# Altium schematic sheet Core.schdoc
size 297 x 209 mm; Symbol: Drawing-Symbol_A4; @Project Name: Weather-Station; @Page Count: 2; @Update Date: 2026-03-24; @Create Date: 2025-12-25; @Schematic Name: Mainboard; @Page No: 1; @Page Name: Core; Company: EasyEDA.com; Version: V1.0; Page Size: A4; @Create Time: 10:59:44; @Update Time: 15:00:32; Border: 1; Width: 1170; Height: 825; Region Start: 1; X Region Count: 6; Y Region Count: 4; Blade Width: 10; Title Block Position: 3; @Board Name: Mainboard; Device: Drawing-Symbol_A4
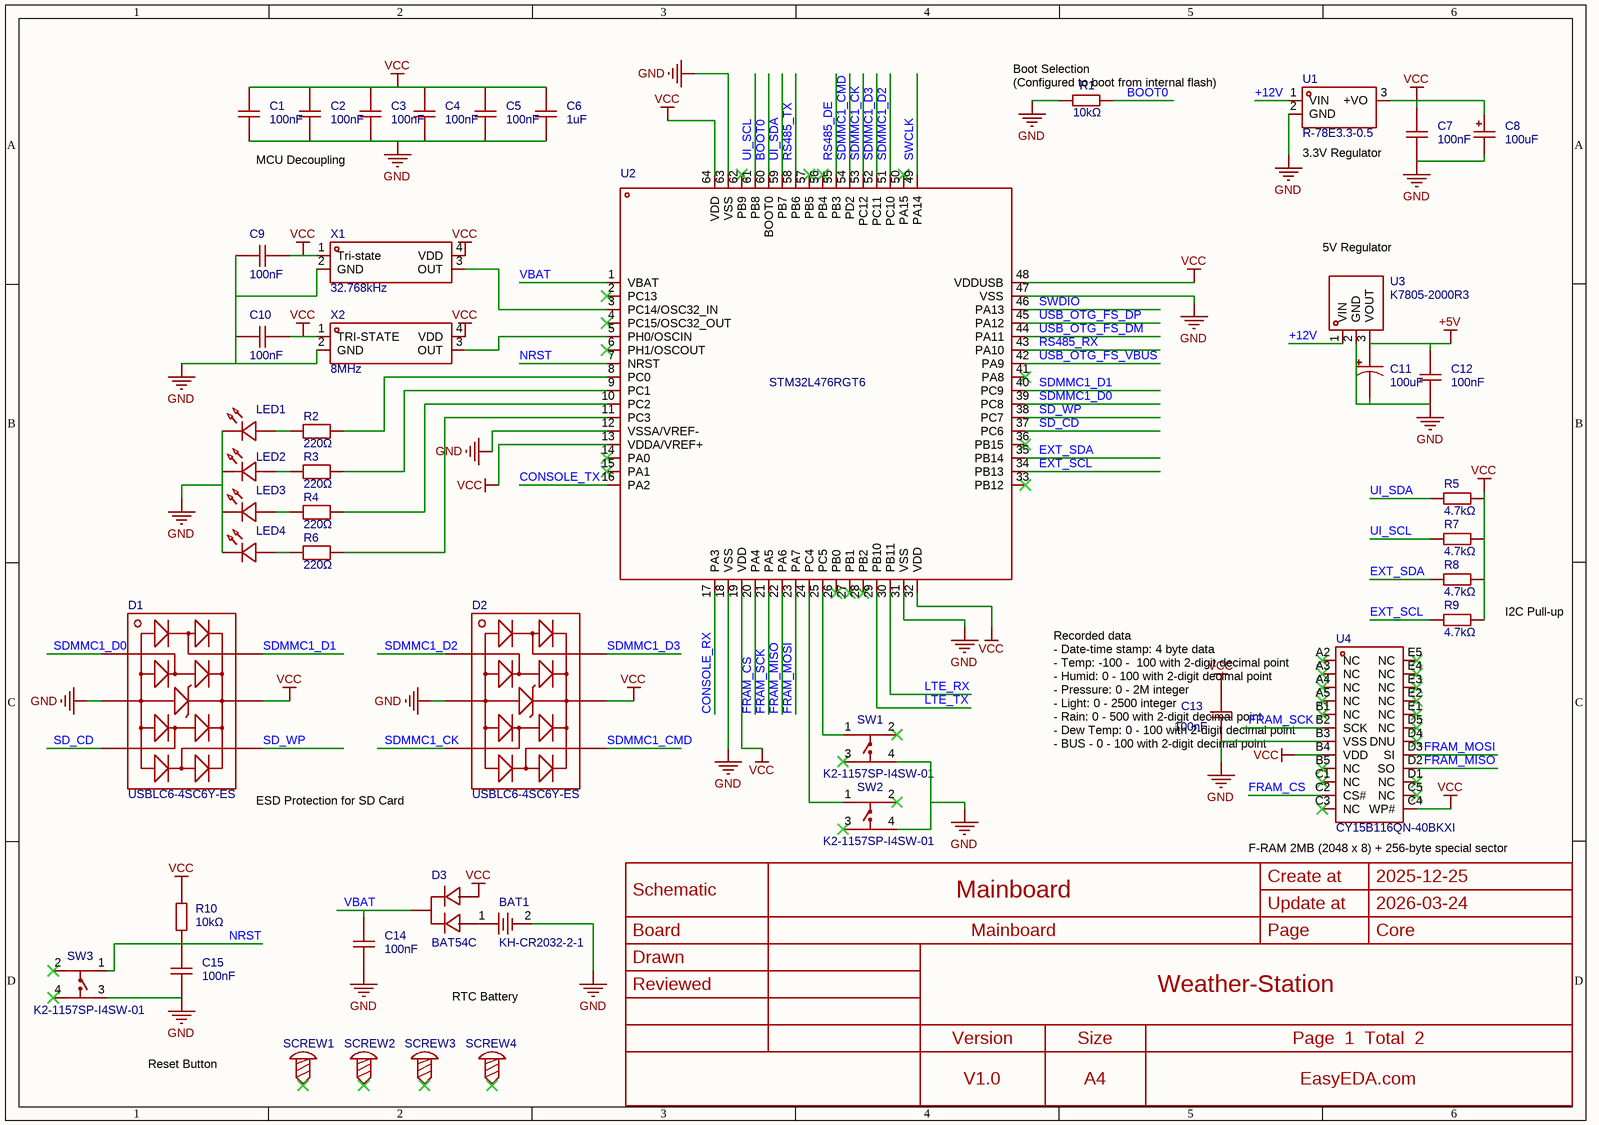
[diagram p0: Core.schdoc]

## Parts
BAT1  KH-CR2032-2-1  [BAT-TH_KH-CR2032-2-1]
C1  100nF  [C0402]
C2  100nF  [C0402]
C3  100nF  [C0402]
C4  100nF  [C0402]
C5  100nF  [C0402]
C6  1uF  [C0603]
C7  100nF  [C0402]
C8  100uF  [CASE-B_3528]
C9  100nF  [C0402]
C10  100nF  [C0402]
C11  100uF  [CAP-SMD_L3.5-W2.8-R-RD]
C12  100nF  [C0402]
C13  100nF  [C0402]
C14  100nF  [C0402]
C15  100nF  [C0402]
D1  USBLC6-4SC6Y-ES  [TSOT-23-6_L2.9-W1.6-P0.95-LS2.8-BR]
D2  USBLC6-4SC6Y-ES  [TSOT-23-6_L2.9-W1.6-P0.95-LS2.8-BR]
D3  BAT54C  [SOT-23-3_L2.9-W1.3-P1.90-LS2.4-BR]
LED1  TZ-P2-0402RTIA1-0.45T  [LED0402-RD_RED]  (value not drawn)
LED2  XL-1005UYC  [LED0402-FD_YELLOW]  (value not drawn)
LED3  BL-HGK37A-AV-TRB  [LED0402]  (value not drawn)
LED4  SZYY0402B  [LED0402-RD_BLUE]  (value not drawn)
R1  10kΩ  [R0402]
R2  220Ω  [R0402]
R3  220Ω  [R0402]
R4  220Ω  [R0402]
R5  4.7kΩ  [R0402]
R6  220Ω  [R0402]
R7  4.7kΩ  [R0402]
R8  4.7kΩ  [R0402]
R9  4.7kΩ  [R0402]
R10  10kΩ  [R0402]
SCREW1  (no value)  [Screw-Hole-M3]
SCREW2  (no value)  [Screw-Hole-M3]
SCREW3  (no value)  [Screw-Hole-M3]
SCREW4  (no value)  [Screw-Hole-M3]
SW1  K2-1157SP-I4SW-01  [SW-SMD_4P-L6.2-W6.2-P4.50-LS8.6]
SW2  K2-1157SP-I4SW-01  [SW-SMD_4P-L6.2-W6.2-P4.50-LS8.6]
SW3  K2-1157SP-I4SW-01  [SW-SMD_4P-L6.2-W6.2-P4.50-LS8.6]
U1  R-78E3.3-0.5  [PWRM-TH_YLPTEC_R-78EXXX]
U2  STM32L476RGT6  [LQFP-64_L10.0-W10.0-P0.50-LS12.0-BL]
U3  K7805-2000R3  [PWRM-TH_K78XX-2000R3]
U4  CY15B116QN-40BKXI  [TFBGA-24_L8.0-W6.0-P1.00-TL_SPANSION_E2A024]
X1  32.768kHz  [OSC-SMD_4P-L3.2-W2.5-BL_TG-5006CE]
X2  8MHz  [OSC-SMD_4P-L3.2-W2.5-BL]

## Nets
+5V: C11.1 C12.1 U3.3(VOUT)
GND: BAT1.2 C1.2 C2.2 C3.2 C4.2 C5.2 C6.2 C7.2 C8.2 C9.1 C10.1 C11.2 C12.2 C13.2 C14.1 C15.2 D1.2 D2.2 LED1.1(K) LED2.2(K) LED3.1(K) LED4.1(K) R1.2 SW1.4 SW2.4 SW3.3 U1.2(GND) U2.12(VSSA/VREF-) U2.18(VSS) U2.31(VSS) U2.47(VSS) U2.63(VSS) U3.2(GND) U4.B3(VSS) X1.2(GND) X2.2(GND)
VCC: C1.1 C2.1 C3.1 C4.1 C5.1 C6.1 C7.1 C8.1 C9.2 C10.2 C13.1 D1.5 D2.5 D3.2 R5.1 R7.1 R8.1 R9.1 R10.2 U1.3(+VO) U2.13(VDDA/VREF+) U2.19(VDD) U2.32(VDD) U2.48(VDDUSB) U2.64(VDD) U4.B4(VDD) U4.C4(WP#) X1.1(Tri-state) X1.4(VDD) X2.1(TRI-STATE) X2.4(VDD)
+12V: U1.1(VIN) U3.1(VIN)
BOOT0: R1.1 U2.60(BOOT0)
CONSOLE_RX: U2.17(PA3)
CONSOLE_TX: U2.16(PA2)
EXT_SCL: R9.2 U2.34(PB13)
EXT_SDA: R8.2 U2.35(PB14)
FRAM_CS: U2.20(PA4) U4.C2(CS#)
FRAM_MISO: U2.22(PA6) U4.D2(SO)
FRAM_MOSI: U2.23(PA7) U4.D3(SI)
FRAM_SCK: U2.21(PA5) U4.B2(SCK)
LTE_RX: U2.30(PB11)
LTE_TX: U2.29(PB10)
NRST: C15.1 R10.1 SW3.1 U2.7(NRST)
RS485_DE: U2.55(PB3)
RS485_RX: U2.43(PA10)
RS485_TX: U2.58(PB6)
SD_CD: D1.3 U2.37(PC6)
SD_WP: D1.4 U2.38(PC7)
SDMMC1_CK: D2.3 U2.53(PC12)
SDMMC1_CMD: D2.4 U2.54(PD2)
SDMMC1_D0: D1.1 U2.39(PC8)
SDMMC1_D1: D1.6 U2.40(PC9)
SDMMC1_D2: D2.1 U2.51(PC10)
SDMMC1_D3: D2.6 U2.52(PC11)
SWCLK: U2.49(PA14)
SWDIO: U2.46(PA13)
UI_SCL: R7.2 U2.61(PB8)
UI_SDA: R5.2 U2.59(PB7)
USB_OTG_FS_DM: U2.44(PA11)
USB_OTG_FS_DP: U2.45(PA12)
USB_OTG_FS_VBUS: U2.42(PA9)
VBAT: C14.2 D3.3 U2.1(VBAT)
NetBAT1_1: BAT1.1 D3.1
NetLED1_2: LED1.2(A) R2.2
NetLED2_1: LED2.1(A) R3.2
NetLED3_2: LED3.2(A) R4.2
NetLED4_2: LED4.2(A) R6.2
NetR2_1: R2.1 U2.8(PC0)
NetR3_1: R3.1 U2.9(PC1)
NetR4_1: R4.1 U2.10(PC2)
NetR6_1: R6.1 U2.11(PC3)
NetSW1_1: SW1.1 U2.25(PC5)
NetSW2_1: SW2.1 U2.24(PC4)
NetU2_3: U2.3(PC14/OSC32_IN) X1.3(OUT)
NetU2_5: U2.5(PH0/OSCIN) X2.3(OUT)

Not connected (* = marked no-connect by the designer): SCREW1 1*; SCREW2 1*; SCREW3 1*; SCREW4 1*; SW1 2* 3*; SW2 2* 3*; SW3 2* 4*; U2 2(PC13)* 4(PC15/OSC32_OUT)* 6(PH1/OSCOUT)* 14(PA0)* 15(PA1)* 26(PB0)* 27(PB1)* 28(PB2)* 33(PB12)* 36(PB15)* 41(PA8)* 50(PA15)* 56(PB4)* 57(PB5)* 62(PB9)*; U4 A2(NC)* A3(NC)* A4(NC)* A5(NC)* B1(NC)* B5(NC)* C1(NC)* C3(NC)* C5(NC)* D1(NC)* D4(DNU)* D5(NC)* E1(NC)* E2(NC)* E3(NC)* E4(NC)* E5(NC)*

## Notes on the sheet
- Boot Selection
  (Configured to boot from internal flash)
- MCU Decoupling
- 3.3V Regulator
- 5V Regulator
- (near C13) Recorded data
  - Date-time stamp: 4 byte data
  - Temp: -100 -  100 with 2-digit decimal point
  - Humid: 0 - 100 with 2-digit decimal point
  - Pressure: 0 - 2M integer
  - Light: 0 - 2500 integer
  - Rain: 0 - 500 with 2-digit decimal point
  - Dew Temp: 0 - 100 with 2-digit decimal point
  - BUS - 0 - 100 with 2-digit decimal point
- I2C Pull-up
- ESD Protection for SD Card
- (near U4) F-RAM 2MB (2048 x 8) + 256-byte special sector
- RTC Battery
- Reset Button
- Create at
- 2025-12-25
- Schematic
- Board
- Mainboard
- Update at
- Page
- 2026-03-24
- Core
- Drawn
- Reviewed
- Weather-Station
- Version
- V1.0
- Size
- A4
- Page  1  Total  2
- EasyEDA.com

## Library data of the parts
BAT1 = KH-CR2032-2-1: Manufacturer: kinghelm(金航标); Check: true; AddInBom: yes; ModelId: b51f1f336f474e1d8c9aad4808dc7c6b; ModelTransform: 964.89776,873.835,0,0,0,0,-48.937,0,-137.795; Symbol: KH-CR2032-2-1; Device: KH-CR2032-2-1; LCSC Part Name: KH-CR2032-2-1; SupplierPart: C5365915; ManufacturerPart: KH-CR2032-2-1; Supplier Footprint: -; JLCPCB Part Class: Extended Part; Datasheet: https://atta.szlcsc.com/upload/public/pdf/source/20230301/F3ED62C53898C1F99BC47B7A2E148BA2.pdf; Supplier: LCSC; ConvertToPcb: yes; FootprintName: BAT-TH_KH-CR2032-2-1; ModelName: BAT-TH_KH-CR2032-2-1
C1-C5 C7 C9 C10 C12-C15 = CL05B104KO5NNNC: Capacitance:100nF Tolerance:±10% Tolerance:±10% Voltage Rating:16V Temperature Coefficient:X7R; Manufacturer: SAMSUNG(三星); Symbol: CAP; Check: true; AddInBom: yes; ModelId: b7d13df3e9464d7a99d0651d1a5b4d57; ModelName: C0402_L1.0-W0.5-H0.5; ModelTransform: 39.37,19.685,0,0,0,0,0,0,0; Tolerance: ±10%; Voltage Rating: 16V; Temperature Coefficient: X7R; Device: CL05B104KO5NNNC; LCSC Part Name: 100nF ±10% 16V; SupplierPart: C1525; ManufacturerPart: CL05B104KO5NNNC; Supplier Footprint: 0402; JLCPCB Part Class: Basic Part; Datasheet: https://item.szlcsc.com/datasheet/CL05B104KO5NNNC/1877.html; Supplier: LCSC; ConvertToPcb: yes; FootprintName: C0402; Value: 100nF
C6 = C0603X105K025T: Capacitance:1uF Tolerance:±10% Tolerance:±10% Voltage Rating:25V Temperature Coefficient:X7R; Manufacturer: IHHEC(禾伸堂); Symbol: CAP; Check: true; AddInBom: yes; ModelId: 624118aa3cc7497086c383c2d72e0852; ModelName: C0603_L1.6-W0.8-H0.8; ModelTransform: 62.992,31.496,0,0,0,0,0,0,0; Tolerance: ±10%; Voltage Rating: 25V; Temperature Coefficient: X7R; Device: C0603X105K025T; LCSC Part Name: 1uF ±10% 25V; SupplierPart: C559292; ManufacturerPart: C0603X105K025T; Supplier Footprint: 0603; JLCPCB Part Class: Extended Part; Datasheet: https://item.szlcsc.com/datasheet/C0603X105K025T/583174.html; Supplier: LCSC; ConvertToPcb: yes; FootprintName: C0603; Value: 1uF
C8 = TAJB107K006RNJ: Capacitance:100uF Tolerance:±10% Tolerance:±10% Voltage Rating:6.3V Equivalent Series Resistance(ESR):1.7Ω@100kHz Operating Temperature:-55℃~+125℃ Operating Temperature:-55℃~+125℃; Manufacturer: Kyocera AVX; Check: true; AddInBom: yes; ModelId: fcfe77907b4c4657a633363937ce9b62; ModelName: CASE-B_L3.5-W2.8-H1.9; ModelTransform: 145.669,110.236,0,0,0,0,0,0,0; Tolerance: ±10%; Voltage Rating: 6.3V; Symbol: TAJB107K006RNJ; Device: TAJB107K006RNJ; LCSC Part Name: 100uF ±10% 6.3V; SupplierPart: C16133; ManufacturerPart: TAJB107K006RNJ; Supplier Footprint: CASE-B-3528-21(mm); JLCPCB Part Class: Basic Part; Supplier: LCSC; ConvertToPcb: yes; FootprintName: CASE-B_3528; Value: 100uF; Equivalent Series Resistance(ESR): 1.7Ω@100kHz; Operating Temperature: -55℃~+125℃
C11 = CA45A-B-10V-100UF-K: Capacitance:100uF Tolerance:±10% Tolerance:±10% Voltage Rating:10V Current - Leakage:10uA Operating Temperature:-55℃~+125℃ Operating Temperature:-55℃~+125℃; Manufacturer: CEC(振华新云); Check: true; AddInBom: yes; ModelId: df83443d22fe46a3b109041cc3b199dd; ModelName: CASE-B_L3.5-W2.8-H1.9; ModelTransform: 145.669,110.236,0,180,0,0,0,0,0; Tolerance: ±10%; Voltage Rating: 10V; Current - Leakage: 10uA; Symbol: CA45A-B-10V-100UF-K; Device: CA45A-B-10V-100UF-K; LCSC Part Name: 100uF ±10% 10V; SupplierPart: C2976906; ManufacturerPart: CA45A-B-10V-100UF-K; Supplier Footprint: CASE-B-3528-19(mm); JLCPCB Part Class: Extended Part; Datasheet: https://item.szlcsc.com/datasheet/CA45A-B-10V-100UF-K/3385423.html; Supplier: LCSC; ConvertToPcb: yes; FootprintName: CAP-SMD_L3.5-W2.8-R-RD; Value: 100uF; Operating Temperature: -55℃~+125℃
D1 D2 = USBLC6-4SC6Y-ES: Polarity:Unidirectional Reverse Stand-Off Voltage (Vrwm):5V Clamping Voltage:15V Peak Pulse Current (Ipp):4.5A Peak Pulse Power Dissipation (Ppp):60W@8/20us Voltage - Breakdown:6V Reverse Leakage Current (Ir):1uA Number of Channels:4 Operating Temperature; Manufacturer: ElecSuper(静芯); Check: true; AddInBom: yes; ModelId: b82f856f33de448a91344795012188a2; ModelName: TSOT-23-6_L2.9-W1.6-H1.1-LS2.8-P0.95; ModelTransform: 110.45568,114.173,0,180,0,0,-0.005,-0.0005,0; Reverse Stand-Off Voltage (Vrwm): 5V; Clamping Voltage: 15V; Peak Pulse Current (Ipp): 4.5A; Voltage - Breakdown: 6V; Reverse Leakage Current (Ir): 1uA; Number of Channels: 4; level of protection: IEC 61000-4-2; Type: ESD; Junction Capacitance: 0.6pF；0.3pF; Symbol: USBLC6-4SC6Y-ES; Device: USBLC6-4SC6Y-ES; LCSC Part Name: V05，4路单向+带VBUS防护ESD静电防护器件，20kV，CJ：0.6pF；HDMI/USB/RJ45高速接口通讯防护; SupplierPart: C19170931; ManufacturerPart: USBLC6-4SC6Y-ES; Supplier Footprint: SOT-23-6L; JLCPCB Part Class: Extended Part; Datasheet: https://item.szlcsc.com/datasheet/USBLC6-4SC6Y-ES/20380803.html; Supplier: LCSC; ConvertToPcb: yes; FootprintName: TSOT-23-6_L2.9-W1.6-P0.95-LS2.8-BR; Polarity: Unidirectional; Peak Pulse Power Dissipation (Ppp): 60W@8/20us; Operating Temperature: -
D3 = BAT54C_C42441801: Diode Configuration:Independent Voltage - Forward(Vf@If):1V@100mA Voltage - DC Reverse(Vr):30V Current - Rectified:200mA Reverse Leakage Current (Ir):2uA@25V Non-Repetitive Peak Forward Surge Current:600mA; Manufacturer: TDSEMIC(拓电半导体); Check: true; AddInBom: yes; ModelId: 62a57c6760504a01965db6419a6d07df; ModelName: SOT-23-3P_L2.9-W1.3-H1.0-LS2.4-P0.95; ModelTransform: 98.425,114.173,0,180,0,0,0.0005,-0.0005,0; Voltage - DC Reverse(Vr): 30V; Current - Rectified: 200mA; Non-Repetitive Peak Forward Surge Current: 600mA; Symbol: BAT54C_C42441801; Device: BAT54C_C42441801; LCSC Part Name: BAT54C; SupplierPart: C42441801; ManufacturerPart: BAT54C; Supplier Footprint: SOT-23; JLCPCB Part Class: Extended Part; Datasheet: https://item.szlcsc.com/datasheet/BAT54C/44491126.html; Supplier: LCSC; ConvertToPcb: yes; FootprintName: SOT-23-3_L2.9-W1.3-P1.90-LS2.4-BR; Diode Configuration: Independent; Voltage - Forward(Vf@If): 1V@100mA; Reverse Leakage Current (Ir): 2uA@25V
LED1 = TZ-P2-0402RTIA1-0.45T: Illumination Color:Red Voltage - Forward(Vf):1.8V~2.4V Voltage - Forward(Vf):1.8V~2.4V Power(Watts):60mW Forward Current:20mA Wavelength - Dominant:620nm~625nm Wavelength - Dominant:620nm~625nm Peak Wavelength:633nm Diode Configuration:- Lens Color:Water; Manufacturer: TUOZHAN(拓展光电); Check: true; AddInBom: yes; ModelId: 40582407f83840798c653124388df4d1; ModelTransform: 40.1574,19.685,0,0,0,0,0,0,0; Illumination Color: Red; Power(Watts): 60mW; Forward Current: 20mA; Peak Wavelength: 633nm; Lens Color: Water Clear; Luminous Intensity: 200mcd; Viewing Angle: 120°; Symbol: TZ-P2-0402RTIA1-0.45T; Device: TZ-P2-0402RTIA1-0.45T; LCSC Part Name: 红灯; SupplierPart: C779449; ManufacturerPart: TZ-P2-0402RTIA1-0.45T; Supplier Footprint: 0402; JLCPCB Part Class: Extended Part; Datasheet: https://item.szlcsc.com/datasheet/TZ-P2-0402RTIA1-0.45T/829110.html; Supplier: LCSC; ConvertToPcb: yes; FootprintName: LED0402-RD_RED; ModelName: LED0402-RD_RED; Voltage - Forward(Vf): 1.8V~2.4V; Wavelength - Dominant: 620nm~625nm; Diode Configuration: -; Color Temperature: -; Mounting Style: -; Operating Temperature: -40℃~+80℃
LED2 = XL-1005UYC_C25503856: Illumination Color:Yellow Voltage - Forward(Vf):2.4V Voltage - Forward(Vf):2.4V Power(Watts):50mW Forward Current:20mA Wavelength - Dominant:585nm~595nm Wavelength - Dominant:585nm~595nm Peak Wavelength:590nm Luminous Intensity:210mcd Luminous Intensity:2; Manufacturer: XINGLIGHT(成兴光); Check: true; AddInBom: yes; ModelId: d9a116af52d44bb4a0717b6b494538ba; ModelTransform: 42.126,21.69287,0,0,0,0,0,0,0; Illumination Color: Yellow; Voltage - Forward(Vf): 2.4V; Power(Watts): 50mW; Forward Current: 20mA; Peak Wavelength: 590nm; Luminous Intensity: 210mcd; Viewing Angle: 120°; Symbol: XL-1005UYC_C25503856; Device: XL-1005UYC_C25503856; LCSC Part Name: 0402黄光贴片式发光二极管; SupplierPart: C25503856; ManufacturerPart: XL-1005UYC; Supplier Footprint: 0402; JLCPCB Part Class: Extended Part; Datasheet: https://item.szlcsc.com/datasheet/XL-1005UYC/27234970.html; Supplier: LCSC; ConvertToPcb: yes; FootprintName: LED0402-FD_YELLOW; ModelName: LED0402-FD_YELLOW; Wavelength - Dominant: 585nm~595nm; Operating Temperature: -40℃~+85℃
LED3 = BL-HGK37A-AV-TRB: Illumination Color:Green Voltage - Forward(Vf):2.8V Voltage - Forward(Vf):2.8V Power(Watts):70mW Forward Current:5mA Wavelength - Dominant:520nm~535nm Wavelength - Dominant:520nm~535nm Peak Wavelength:520nm Diode Configuration:Discrete Diode Lens Color:Wa; Manufacturer: BrtLed(佰鸿); 3D Model Transform: 40.1574,19.685,0,0,0,0,0,0,0; Emitted Color: Emerald; Power Dissipation: 110mW; Check: true; AddInBom: yes; Illumination Color: Green; Voltage - Forward(Vf): 2.8V; Power(Watts): 70mW; Forward Current: 5mA; Peak Wavelength: 520nm; Lens Color: Water Clear; Luminous Intensity: 210mcd; Viewing Angle: 120°; Dominant Wavelength: 520nm~535nm; Color Temperature: -; Mounting Sytle: -; Symbol: BL-HGK37A-AV-TRB; Device: BL-HGK37A-AV-TRB; LCSC Part Name: 0402绿色; SupplierPart: C5123485; ManufacturerPart: BL-HGK37A-AV-TRB; Supplier Footprint: 0402; JLCPCB Part Class: Extended Part; Datasheet: https://item.szlcsc.com/datasheet/BL-HGK37A-AV-TRB/5717309.html; Supplier: LCSC; ConvertToPcb: yes; FootprintName: LED0402; Wavelength - Dominant: 520nm~535nm; Diode Configuration: Discrete Diode; Mounting Style: Top-mount; Operating Temperature: -40℃~+85℃
LED4 = SZYY0402B: Emitted Color:Blue Power Dissipation:- Forward Current:5mA Dominant Wavelength:466nm~469nm Dominant Wavelength:466nm~469nm Peak Wavelength:- Color Temperature:- Color Temperature:- Viewing Angle:120° Mounting Sytle:- Operating Temperature:-40℃~+85℃ Operat; Manufacturer: yongyu(永裕光电); Illumination Color: Blue; Voltage - Forward(Vf): 3.3V; Wavelength - Dominant: 455nm~475nm; Lens Color: Water Clear; Luminous Intensity: 240mcd; Check: true; AddInBom: yes; ModelId: b6291e20d463426285984a29308bda21; ModelName: LED0402_L1.0-W0.5-H0.2; ModelTransform: 40.1574,19.685,0,0,0,0,0,-0.0005,0; Forward Current: 5mA; Viewing Angle: 120°; Power(Watts): -; Mounting Style: op View Mount; Symbol: SZYY0402B; Device: SZYY0402B; LCSC Part Name: 蓝灯; SupplierPart: C434447; ManufacturerPart: SZYY0402B; Supplier Footprint: 0402; JLCPCB Part Class: Extended Part; Datasheet: https://atta.szlcsc.com/upload/public/pdf/source/20210222/C434447_30232BB6183B52026028ECA50B9DAB35.pdf; Supplier: LCSC; ConvertToPcb: yes; FootprintName: LED0402-RD_BLUE; Emitted Color: Blue; Power Dissipation: -; Dominant Wavelength: 466nm~469nm; Peak Wavelength: -; Color Temperature: -; Mounting Sytle: -; Operating Temperature: -40℃~+85℃
R1 R10 = SCR0402F10K: Type:Thick Film Resistor Resistance:10kΩ Tolerance:±1% Tolerance:±1% Power(Watts):62.5mW Voltage-Supply(Max):50V Operating Temperature:-55℃~+155℃ Operating Temperature:-55℃~+155℃; Manufacturer: VO(翔胜); Symbol: Res; Check: true; AddInBom: yes; ModelId: efdecb7dae4442949d28eecaf748420f; ModelName: R0402_L1.0-W0.5-H0.4; ModelTransform: 39.37,19.685,0,0,0,0,0,0,0; Tolerance: ±1%; Power(Watts): 62.5mW; Voltage-Supply(Max): 50V; Device: SCR0402F10K; LCSC Part Name: 厚膜电阻 10kΩ ±1% 62.5mW; SupplierPart: C3015825; ManufacturerPart: SCR0402F10K; Supplier Footprint: 0402; JLCPCB Part Class: Extended Part; Datasheet: https://item.szlcsc.com/datasheet/SCR0402F10K/3528279.html; Supplier: LCSC; ConvertToPcb: yes; FootprintName: R0402; Type: Thick Film Resistor; Value: 10kΩ; Operating Temperature: -55℃~+155℃
R2-R4 R6 = FRC0402F2200TS: Type:Thick Film Resistor Resistance:220Ω Tolerance:±1% Tolerance:±1% Power(Watts):62.5mW Voltage-Supply(Max):50V Temperature Coefficient:±100ppm/℃ Temperature Coefficient:±100ppm/℃ Operating Temperature:-55℃~+155℃ Operating Temperature:-55℃~+155℃; Manufacturer: FOJAN(富捷); Check: true; AddInBom: yes; ModelId: efdecb7dae4442949d28eecaf748420f; ModelName: R0402_L1.0-W0.5-H0.4; ModelTransform: 39.37,19.685,0,0,0,0,0,0,0; Tolerance: ±1%; Power(Watts): 62.5mW; Voltage-Supply(Max): 50V; Symbol: FRC0402F2200TS; Device: FRC0402F2200TS; LCSC Part Name: 220Ω ±1% 62.5mW 厚膜电阻; SupplierPart: C2909336; ManufacturerPart: FRC0402F2200TS; Supplier Footprint: 0402; JLCPCB Part Class: Extended Part; Datasheet: https://item.szlcsc.com/datasheet/FRC0402F2200TS/3186271.html; Supplier: LCSC; ConvertToPcb: yes; FootprintName: R0402; Type: Thick Film Resistor; Value: 220Ω; Temperature Coefficient: ±100ppm/℃; Operating Temperature: -55℃~+155℃
R5 R7-R9 = 0402WGF4701TCE: Type:Thick Film Resistor Resistance:4.7kΩ Tolerance:±1% Tolerance:±1% Power(Watts):62.5mW Voltage-Supply(Max):50V Temperature Coefficient:±100ppm/℃ Temperature Coefficient:±100ppm/℃ Operating Temperature:-55℃~+155℃ Operating Temperature:-55℃~+155℃; Manufacturer: UNI-ROYAL(厚声); Symbol: Res; Check: true; AddInBom: yes; ModelId: efdecb7dae4442949d28eecaf748420f; ModelName: R0402_L1.0-W0.5-H0.4; ModelTransform: 39.37,19.685,0,0,0,0,0,0,0; Tolerance: ±1%; Power(Watts): 62.5mW; Voltage-Supply(Max): 50V; Device: 0402WGF4701TCE; LCSC Part Name: 4.7kΩ ±1% 62.5mW 厚膜电阻; SupplierPart: C25900; ManufacturerPart: 0402WGF4701TCE; Supplier Footprint: 0402; JLCPCB Part Class: Basic Part; Datasheet: https://item.szlcsc.com/datasheet/0402WGF4701TCE/26643.html; Supplier: LCSC; ConvertToPcb: yes; FootprintName: R0402; Type: Thick Film Resistor; Value: 4.7kΩ; Temperature Coefficient: ±100ppm/℃; Operating Temperature: -55℃~+155℃
SCREW1-SCREW4 = Screw-Hole-M3: Add into BOM: no; Check: true; ConvertToPcb: yes; Device: Screw-Hole-M3; Supplier Footprint: 插件; SymbolName: Screw-Hole; FootprintName: Screw-Hole-M3
SW1-SW3 = K2-1157SP-I4SW-01: Circuit:- Self Lock / No Lock:- Actuator Style:Round Button IP Rating:- Mounting Type:Surface Mount,Vertical Contact Current:50mA Voltage Rating:12V Actuator/Cap Color:Red With Lamp:Without Termination Style:Gull Wing Operating Force:2.5N Operating Temper; Manufacturer: 韩国韩荣; Symbol: K2-1157SP-I4SW-04; Check: true; AddInBom: yes; ModelId: dc584626a6f348c89e0ed204f802fadb; ModelName: SW-SMD_4P-L6.2-W6.2-H3.1-P4.50-LS8.6; ModelTransform: 334.645,244.094,0,0,0,0,0,0,0; Contact Current: 50mA; Voltage Rating: 12V; Actuator/Cap Color: Red; Operating Force: 2.5N; Life: 100,000 Cycles; Device: K2-1157SP-I4SW-01; LCSC Part Name: 6.4x6.2x3.7红柄开关; SupplierPart: C2909692; ManufacturerPart: K2-1157SP-I4SW-01; Supplier Footprint: SMD; JLCPCB Part Class: Extended Part; Datasheet: https://item.szlcsc.com/datasheet/K2-1157SP-I4SW-01/3187750.html; Supplier: LCSC; ConvertToPcb: yes; FootprintName: SW-SMD_4P-L6.2-W6.2-P4.50-LS8.6; Circuit: -; Self Lock / No Lock: -; Actuator Style: Round Button; IP Rating: -; Mounting Type: Surface Mount,Vertical; With Lamp: Without; Termination Style: Gull Wing; Operating Temperature: -25℃~+80℃
U1 = R-78E3.3-0.5: Function:Buck Number of Outputs:1 Voltage - Supply:4.75V~36V Voltage - Supply:4.75V~36V Output Voltage:3.3V Output Voltage:3.3V Output Current(Max):500mA Output Current(Max):500mA Output Power:- Conversion Efficiency:86% Conversion Efficiency:86% Capaciti; Manufacturer: YLPTEC(易川); Check: true; AddInBom: yes; ModelId: b1af7a9893aa495aad19994fe5e69fc4; ModelTransform: 452.755,297.6372,0,0,0,0,0,70.866,-157.48; Function: Buck; Number of Outputs: 1; Output Voltage: 3.3V; Output Current(Max): 500mA; Conversion Efficiency: 86%; Capacitive Load(Max): 680uF; Symbol: R-78E3.3-0.5; Device: R-78E3.3-0.5; LCSC Part Name: DC/DC电源模块; SupplierPart: C18212316; ManufacturerPart: R-78E3.3-0.5; Supplier Footprint: SIP,11.5x7.6mm; JLCPCB Part Class: Extended Part; Datasheet: https://item.szlcsc.com/datasheet/R-78E3.3-0.5/19382656.html; Supplier: LCSC; ConvertToPcb: yes; FootprintName: PWRM-TH_YLPTEC_R-78EXXX; ModelName: PWRM-TH_YLPTEC_R-78EXXX; Voltage - Supply: 4.75V~36V; Output Power: -; Features: Short Circuit Protection
U2 = STM32L476RGT6: CPU Core:ARM-M4 CPU Maximum Speed:80MHz Program Storage Size:1MB Program Memory Type:FLASH Number of I/O:51 ADC (Bit):12bit DAC (Bit):12bit Voltage - Supply:1.71V~3.6V Voltage - Supply:1.71V~3.6V Applications:-; Manufacturer: ST(意法半导体); Check: true; AddInBom: yes; ModelId: 9827011a374c44f2b05ac1eacaf21ae0; ModelName: LQFP-64_L10.0-W10.0-H1.4-LS12.0-P0.50; ModelTransform: 472.441,472.441,0,0,0,0,0,0.465,0; CPU Core: ARM-M4; CPU Maximum Speed: 80MHz; Program Storage Size: 1MB; Program Memory Type: FLASH; Number of I/O: 51; ADC (Bit): 12bit; Symbol: STM32L476RGT6; Device: STM32L476RGT6; LCSC Part Name: 带FPU的超低功耗80 Mhz Arm Cortex-M4 MCU，具有1 MB Flash存储器、LCD、USB OTG和DFSDM; SupplierPart: C74797; ManufacturerPart: STM32L476RGT6; Supplier Footprint: LQFP-64(10x10); JLCPCB Part Class: Extended Part; Datasheet: https://item.szlcsc.com/datasheet/STM32L476RGT6/75919.html; Supplier: LCSC; ConvertToPcb: yes; FootprintName: LQFP-64_L10.0-W10.0-P0.50-LS12.0-BL; DAC (Bit): 12bit; Voltage - Supply: 1.71V~3.6V; Applications: -
U3 = K7805-2000R3_C48888165: Voltage - Supply:6.5V~36V Voltage - Supply:6.5V~36V Output Voltage Accuracy:±4% Output Voltage Accuracy:±4% Output Voltage:5V Output Voltage:5V Output Current(Max):2A Output Current(Max):2A Conversion Efficiency:96% Conversion Efficiency:96% Capacitive Lo; Manufacturer: RLT(瑞率特); AddInBom: yes; ModelId: 91b4ed295acf4a48a74faca7346ecf60; ModelTransform: 456.692,335.0387,0,0,0,0,0,-86.654,-161.417; Output Voltage Accuracy: ±4%; Output Voltage: 5V; Output Current(Max): 2A; Conversion Efficiency: 96%; Capacitive Load(Max): 1000uF; Supply Current (Iq): 10mA; Switching Frequency: 410kHz; Ripple Noise: 50mVp-p; Symbol: K7805-2000R3_C48888165; Device: K7805-2000R3_C48888165; LCSC Part Name: 非隔离式 DC-DC 转换器; SupplierPart: C48888165; ManufacturerPart: K7805-2000R3; Supplier Footprint: SIP,11.5x9mm; JLCPCB Part Class: Extended Part; Datasheet: https://item.szlcsc.com/datasheet/K7805-2000R3/51192757.html; Supplier: LCSC; ConvertToPcb: yes; FootprintName: PWRM-TH_K78XX-2000R3; ModelName: PWRM-TH_K78XX-2000R3; Voltage - Supply: 6.5V~36V; Features: Short Circuit Protection；Over Temperature Protection; Length: 11.6mm; Width: 8.5mm; Height: 17.5mm; Operating Temperature Range: -40℃~+85℃
U4 = CY15B116QN-40BKXI: Manufacturer: Infineon(英飞凌); Check: true; AddInBom: yes; ModelId: 6f827266fac94ee0adc0644804d8591b; ModelTransform: 236.22,314.96,0,0,0,0,0,0,0; Symbol: CY15B116QN-40BKXI; Device: CY15B116QN-40BKXI; LCSC Part Name: CY15B116QN-40BKXI; SupplierPart: C5613284; ManufacturerPart: CY15B116QN-40BKXI; Supplier Footprint: FBGA-24(6x8); JLCPCB Part Class: Extended Part; Datasheet: https://atta.szlcsc.com/upload/public/pdf/source/20241031/9648D73077922A882E979CDEC6925939.pdf; Supplier: LCSC; ConvertToPcb: yes; FootprintName: TFBGA-24_L8.0-W6.0-P1.00-TL_SPANSION_E2A024; ModelName: TFBGA-24_L8.0-W6.0-P1.00-TL_SPANSION_E2A024
X1 = OK2EL89CJI-111YLC-32.768K: Frequency:32.768kHz Normal temperature Frequency Tolerance:±10ppm Normal temperature Frequency Tolerance:±10ppm Output Type:CMOS Voltage - Supply:1.8V~3.3V Voltage - Supply:1.8V~3.3V Frequency Stability:±20ppm Frequency Stability:±20ppm Operating Temperat; Manufacturer: YXC(扬兴晶振); Check: true; AddInBom: yes; ModelId: ec30f4f0dc5547469f200266e0da4321; ModelTransform: 126.7714,99.2124,0,0,0,0,0.001,0.003,0; Normal temperature Frequency Tolerance: ±10ppm; Output Type: CMOS; Frequency Stability: ±20ppm; Symbol: OK2EL89CJI-111YLC-32.768K; Device: OK2EL89CJI-111YLC-32.768K; LCSC Part Name: YSO120TK 32.768KHZ 1.8V-3.3V -40~85℃ CMOS; SupplierPart: C5280579; ManufacturerPart: OK2EL89CJI-111YLC-32.768K; Supplier Footprint: SMD3225-4P; JLCPCB Part Class: Extended Part; Datasheet: https://item.szlcsc.com/datasheet/OK2EL89CJI-111YLC-32.768K/6016761.html; Supplier: LCSC; ConvertToPcb: yes; FootprintName: OSC-SMD_4P-L3.2-W2.5-BL_TG-5006CE; ModelName: OSC-SMD_4P-L3.2-W2.5-BL_TG-5006CE; Value: 32.768kHz; Voltage - Supply: 1.8V~3.3V; Operating Temperature: -40℃~+85℃
X2 = XOS32008000LT00351005: Frequency:8MHz Normal temperature Frequency Tolerance:±10ppm Normal temperature Frequency Tolerance:±10ppm Output Type:CMOS Voltage - Supply:1.62V~3.63V Voltage - Supply:1.62V~3.63V Current - Supply:5mA Frequency Stability:±20ppm Frequency Stability:±20pp; Manufacturer: 同晶; Check: true; AddInBom: yes; ModelId: 3d8e5f33629249f9a4089449c02742d4; ModelName: OSC-SMD_4P-L3.2-W2.5-H1.0; ModelTransform: 125.984,98.425,0,0,0,0,0,0,0; Normal temperature Frequency Tolerance: ±10ppm; Output Type: CMOS; Current - Supply: 5mA; Frequency Stability: ±20ppm; Symbol: XOS32008000LT00351005; Device: XOS32008000LT00351005; LCSC Part Name: 8MHz 4P 3225 1.8V-3.3V ±10PPM -40~85℃ (±20PPM) CMOS; SupplierPart: C37635413; ManufacturerPart: XOS32008000LT00351005; Supplier Footprint: SMD3225-4P; JLCPCB Part Class: Extended Part; Datasheet: https://item.szlcsc.com/datasheet/XOS32008000LT00351005/39361345.html; Supplier: LCSC; ConvertToPcb: yes; FootprintName: OSC-SMD_4P-L3.2-W2.5-BL; Value: 8MHz; Voltage - Supply: 1.62V~3.63V; Operating Temperature: -40℃~+85℃